# Altium schematic sheet Sensors.SchDoc
size A3; Author: ALP Electronics; CompanyName: ALP Electronics; DrawnBy: Caner Alp; Engineer: Caner Alp; Organization: ALP Electronics; Address2: Västerås; Address4: Sweden; SheetNumber: 14; SheetTotal: 14
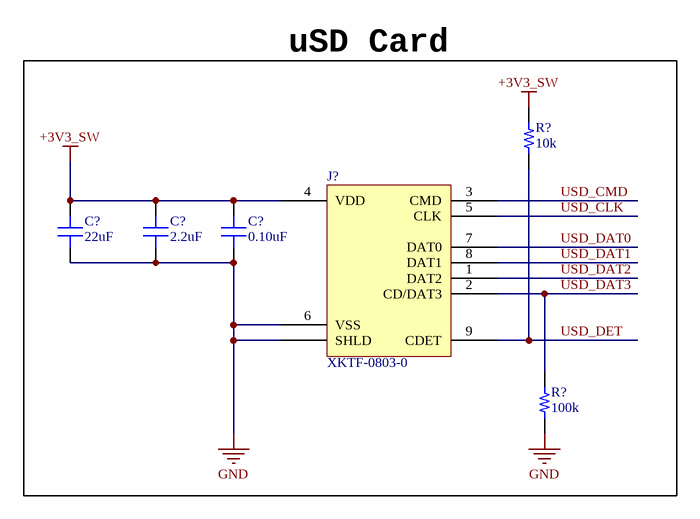
[diagram p0: Sensors.SchDoc]

## Parts
(Parts that share a designator on the sheet are numbered #1, #2 ... from top to bottom, then left to right.)
C?#1  22uF  [CAP 0805/2012]
C?#2  2.2uF  [CAP 0402/1005]
C?#3  0.10uF  [CAP 0402/1005]
J?  XKTF-0803-0  [XKTF-0803-0]
R?#1  10k  [RES 0402/1005]
R?#2  100k  [RES 0402/1005]

## Blocks framed on the sheet
uSD Card: C?#1-C?#3 J? R?#1 R?#2

## Nets
+3V3_SW: C?#1.2 C?#2.2 C?#3.2 J?.4(VDD) R?#1.2
GND: C?#1.1 C?#2.1 C?#3.1 J?.6(VSS) J?.S(SHLD) R?#2.2
USD_CLK: J?.5(CLK)
USD_CMD: J?.3(CMD)
USD_DAT0: J?.7(DAT0)
USD_DAT1: J?.8(DAT1)
USD_DAT2: J?.1(DAT2)
USD_DAT3: J?.2(CD/DAT3) R?#2.1
USD_DET: J?.9(CDET) R?#1.1

## Notes on the sheet
- Title:
- Size:
- Project:
- A3
- Date:
- Revision:
- Drawn By:
- Sheet
- of

## Library data of the parts
C?#1 = C2012X5R0J226M125AC: CAP CER 22UF 6.3V X5R 0805; Manufacturer: TDK Corporation; TemperatureRange: -55C ~ 85C; Tolerance: 20%; Value: 22uF; Part Number: C2012X5R0J226M125AC; PartId: 4616; Supplier 1: Digi-Key; Supplier Part Number 1: 445-1422-2-ND; ComponentLink1Description: Datasheet; ComponentLink1URL: https://product.tdk.com/info/en/catalog/datasheets/mlcc_commercial_general_en.pdf; ComponentLink2Description: Digi-Key listing; ComponentLink2URL: http://digikey.com/product-detail/en/C2012X5R0J226M125AC/445-1422-2-ND/569048; TemperatureCoefficient: X5R; Voltage: 6.3V; Price: 0,0861; Type: -; Device Package: 0805 (2012 Metric)
C?#2 = JMK105BJ225MV-F: CAP CER 2.2UF 6.3V X5R 0402; Manufacturer: Taiyo Yuden; TemperatureRange: -55C ~ 85C; Tolerance: 20%; Value: 2.2uF; Part Number: JMK105BJ225MV-F; PartId: 12339; Supplier 1: Digi-Key; Supplier Part Number 1: 587-1453-2-ND; ComponentLink1Description: Datasheet; ComponentLink1URL: http://ds.yuden.co.jp/TYCOMPAS/ut/detail.do?productNo=JMK105BJ225MV-F&fileName=JMK105BJ225MV-F_SS&mode=specSheetDownload; ComponentLink2Description: Digi-Key Listing; ComponentLink2URL: https://www.digikey.com/product-detail/en/taiyo-yuden/JMK105BJ225MV-F/587-1453-2-ND/1004041; TemperatureCoefficient: X5R; Voltage: 6.3V; Price: 0,028; Device Package: 0402 (1005 Metric)
C?#3 = LMK105BJ104KV-F: CAP CER 0.1UF 10V X5R 0402; Manufacturer: Taiyo Yuden; TemperatureRange: -55C ~ 85C; Tolerance: 10%; Value: 0.10uF; Part Number: LMK105BJ104KV-F; PartId: 12322; Supplier 1: Digi-Key; Supplier Part Number 1: 587-1227-2-ND; ComponentLink1Description: Datasheet; ComponentLink1URL: http://ds.yuden.co.jp/TYCOMPAS/ut/detail.do?productNo=LMK105BJ104KV-F&fileName=LMK105BJ104KV-F_SS&mode=specSheetDownload; ComponentLink2Description: Digi-Key Listing; ComponentLink2URL: https://www.digikey.com/product-detail/en/taiyo-yuden/LMK105BJ104KV-F/587-1227-2-ND/930579; TemperatureCoefficient: X5R; Voltage: 10V; Price: 0,0021; Device Package: 0402 (1005 Metric)
J? = MOLEX 503398-1892: MICRO SD PUSH/PUSH SMALL 8C; Manufacturer: Molex; Part Number: XKTF-0803-0; PartId: 9289; Supplier 1: Digi-Key; Supplier Part Number 1: WM11190CT-ND
R?#1 = RC0402JR-0710KL: RES SMD 10K OHM 5% 1/16W 0402; Manufacturer: Yageo; TemperatureRange: -55C ~ 155C; TemperatureCoefficient: 100ppm/C; PowerRating: 0.063W, 1/16W; Value: 10k; Part Number: RC0402JR-0710KL; PartId: 14464; Supplier 1: Digi-Key; Supplier Part Number 1: 311-10KJRTR-ND; ComponentLink1Description: Datasheet; ComponentLink1URL: http://www.yageo.com/documents/recent/PYu-RC_Group_51_RoHS_L_04.pdf; ComponentLink2Description: Digi-Key Listing; ComponentLink2URL: https://www.digikey.com/product-detail/en/yageo/RC0402JR-0710KL/311-10KJRTR-ND/726418; Tolerance: 5%; Price: 0,0017; Device Package: 0402 (1005 Metric)
R?#2 = ERJ-2GEJ104X: RES SMD 100K OHM 5% 1/10W 0402; Manufacturer: Panasonic Electronic Components; TemperatureRange: -55C ~ 155C; TemperatureCoefficient: 200ppm/C; PowerRating: 0.1W, 1/10W; Value: 100k; Part Number: ERJ-2GEJ104X; PartId: 10985; Supplier 1: Digi-Key; Supplier Part Number 1: P100KJTR-ND; ComponentLink1Description: Datasheet; ComponentLink1URL: http://industrial.panasonic.com/www-cgi/jvcr13pz.cgi?E+PZ+3+AOA0001+ERJ2GEJ104X+7+WW; ComponentLink2Description: Digi-Key Listing; ComponentLink2URL: https://www.digikey.com/product-detail/en/panasonic-electronic-components/ERJ-2GEJ104X/P100KJTR-ND/146731; Tolerance: 5%; Price: 0,0019; Device Package: 0402 (1005 Metric)